# Altium schematic sheet Sheet4.SchDoc
size A4; SheetNumber: 4; SheetTotal: 6
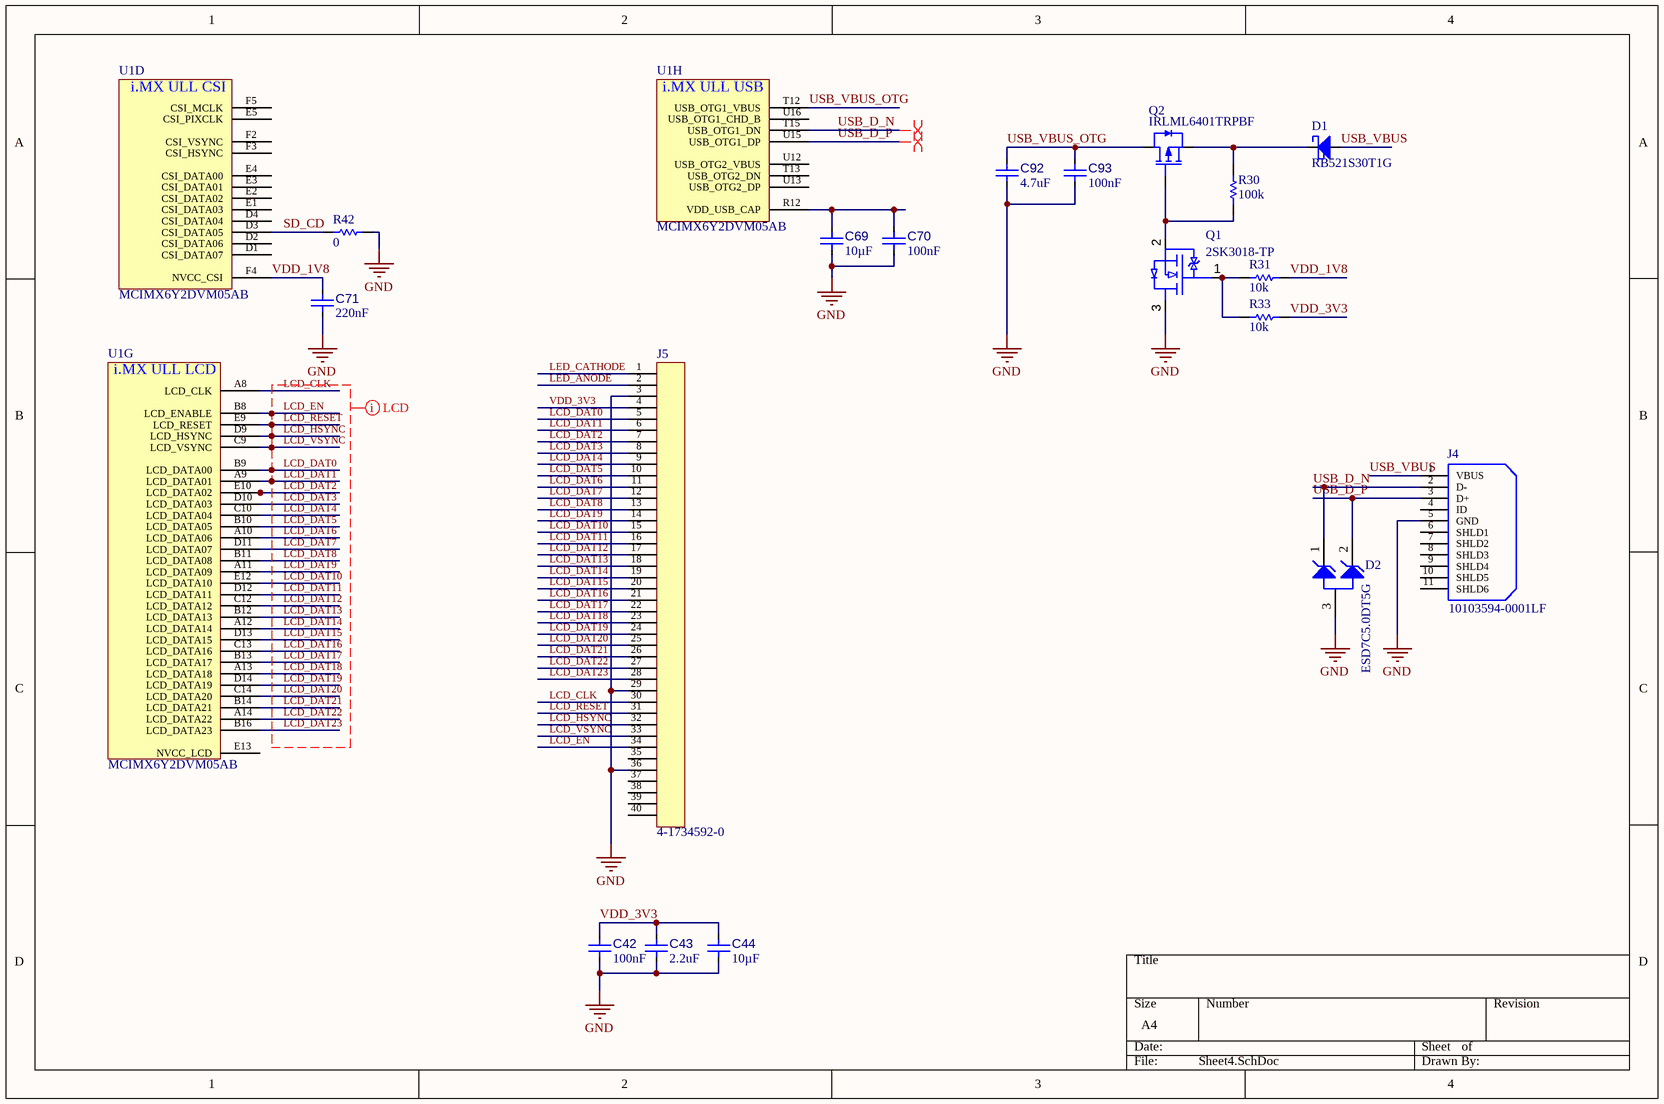
[diagram p0: Sheet4.SchDoc]

## Parts
C42  value 100nF  [0402-SMD-CAP]  (hidden comment: EMF105B7104MVHF)
C43  value 2.2uF  [0603-SMD-CAP]  (hidden comment: GRM188R71A225KE15D)
C44  value 10µF  [0805-SMD-CAP]  (hidden comment: 0805YD106KAT2A)
C69  value 10µF  [0603-SMD-CAP]  (hidden comment: 0603ZD106KAT2A)
C70  value 100nF  [0402-SMD-CAP]  (hidden comment: EMF105B7104MVHF)
C71  value 220nF  [0402-SMD-CAP]  (hidden comment: GRM155R71C224KA12D)
C92  value 4.7uF  [0603-SMD-CAP]  (hidden comment: C0603C475K9PACTU)
C93  value 100nF  [0402-SMD-CAP]  (hidden comment: EMF105B7104MVHF)
D1  RB521S30T1G  [ONSC-SOD-523-2-502-01_V]
D2  ESD7C5.0DT5G  [ONSC-SOT-723-3-631AA-01_V]
J4  10103594-0001LF  [FCI-10103594-0001LF_V]
J5  4-1734592-0  [4-1734592-0-Footprint-1]
Q1  2SK3018-TP  [SOT323]
Q2  IRLML6401TRPBF  [SOT323-IRLML6401]
R30  value 100k  [0402_SMD_RES]  (hidden comment: RC0402FR-07100KL)
R31  value 10k  [0402_SMD_RES]  (hidden comment: Resistor 10k +/-1% 0402 63 mW)
R33  value 10k  [0402_SMD_RES]  (hidden comment: Resistor 10k +/-1% 0402 63 mW)
R42  value 0  [0402_SMD_RES]  (hidden comment: RCS04020000Z0ED)
U1  MCIMX6Y2DVM05AB  [BGA100P9X9-81A]  (parts D,G,H of 11)

## Nets
GND: C42.1 C43.1 C44.2 C69.2 C70.1 C71.2 C92.2 C93.1 D2.3(A) J4.5(GND) J5.3 J5.29 J5.36 Q1.3(D) R42.2
LCD_CLK: J5.30 U1.A8(LCD_CLK)
LCD_DAT0: J5.5 U1.B9(LCD_DATA00)
LCD_DAT1: J5.6 U1.A9(LCD_DATA01)
LCD_DAT2: J5.7 U1.E10(LCD_DATA02)
LCD_DAT3: J5.8 U1.D10(LCD_DATA03)
LCD_DAT4: J5.9 U1.C10(LCD_DATA04)
LCD_DAT5: J5.10 U1.B10(LCD_DATA05)
LCD_DAT6: J5.11 U1.A10(LCD_DATA06)
LCD_DAT7: J5.12 U1.D11(LCD_DATA07)
LCD_DAT8: J5.13 U1.B11(LCD_DATA08)
LCD_DAT9: J5.14 U1.A11(LCD_DATA09)
LCD_DAT10: J5.15 U1.E12(LCD_DATA10)
LCD_DAT11: J5.16 U1.D12(LCD_DATA11)
LCD_DAT12: J5.17 U1.C12(LCD_DATA12)
LCD_DAT13: J5.18 U1.B12(LCD_DATA13)
LCD_DAT14: J5.19 U1.A12(LCD_DATA14)
LCD_DAT15: J5.20 U1.D13(LCD_DATA15)
LCD_DAT16: J5.21 U1.C13(LCD_DATA16)
LCD_DAT17: J5.22 U1.B13(LCD_DATA17)
LCD_DAT18: J5.23 U1.A13(LCD_DATA18)
LCD_DAT19: J5.24 U1.D14(LCD_DATA19)
LCD_DAT20: J5.25 U1.C14(LCD_DATA20)
LCD_DAT21: J5.26 U1.B14(LCD_DATA21)
LCD_DAT22: J5.27 U1.A14(LCD_DATA22)
LCD_DAT23: J5.28 U1.B16(LCD_DATA23)
LCD_EN: J5.34 U1.B8(LCD_ENABLE)
LCD_HSYNC: J5.32 U1.D9(LCD_HSYNC)
LCD_RESET: J5.31 U1.E9(LCD_RESET)
LCD_VSYNC: J5.33 U1.C9(LCD_VSYNC)
LED_ANODE: J5.2
LED_CATHODE: J5.1
SD_CD: R42.1 U1.D3(CSI_DATA05)
USB_D_N: D2.1(K1) J4.2(D-) U1.T15(USB_OTG1_DN)
USB_D_P: D2.2(K2) J4.3(D+) U1.U15(USB_OTG1_DP)
USB_VBUS: D1.1(A) J4.1(VBUS)
USB_VBUS_OTG: C92.1 C93.2 Q2.3(DRAIN) U1.T12(USB_OTG1_VBUS)
VDD_1V8: C71.1 R31.1 U1.F4(NVCC_CSI)
VDD_3V3: C42.2 C43.2 C44.1 J5.4 R33.1
NetC69_1: C69.1 C70.2 U1.R12(VDD_USB_CAP)
NetD1_2: D1.2(K) Q2.2(SOURCE) R30.2
NetQ1_1: Q1.1(G) R31.2 R33.2
NetQ1_2: Q1.2(S) Q2.1(GATE) R30.1

Not connected (* = marked no-connect by the designer): J4 4(ID) 6(SHLD1) 7(SHLD2) 8(SHLD3) 9(SHLD4) 10(SHLD5) 11(SHLD6); J5 35 37 38 39 40; U1 D1(CSI_DATA07) D2(CSI_DATA06) D4(CSI_DATA04) E1(CSI_DATA03) E2(CSI_DATA02) E3(CSI_DATA01) E4(CSI_DATA00) E5(CSI_PIXCLK) E13(NVCC_LCD) F2(CSI_VSYNC) F3(CSI_HSYNC) F5(CSI_MCLK) T13(USB_OTG2_DN) U12(USB_OTG2_VBUS) U13(USB_OTG2_DP) U16(USB_OTG1_CHD_B)

## Layout directives
net class LCD: LCD_CLK, LCD_DAT0, LCD_DAT1, LCD_DAT2, LCD_DAT3, LCD_DAT4, LCD_DAT5, LCD_DAT6, LCD_DAT7, LCD_DAT8, LCD_DAT9, LCD_DAT10, LCD_DAT11, LCD_DAT12, LCD_DAT13, LCD_DAT14, LCD_DAT15, LCD_DAT16, LCD_DAT17, LCD_DAT18, LCD_DAT19, LCD_DAT20, LCD_DAT21, LCD_DAT22, LCD_DAT23, LCD_EN, LCD_HSYNC, LCD_RESET, LCD_VSYNC
differential pair: USB_D_N, USB_D_P

## Notes on the sheet
- (in symbol CMP-003-000001-14, part D) i.MX ULL CSI
- (in symbol CMP-003-000001-14, part G) i.MX ULL LCD
- (in symbol CMP-003-000001-14, part H) i.MX ULL USB

## Library data of the parts
C42 C70 C93 = CMP-001-00001-14: Chip Capacitor, 0.1 uF, +/- 5%, 16 V, 0402 (1005 Metric); Capacitor Type: Ceramic; Voltage Rating: 16V; Case/Package: 0402; Max Operating Temperature: 125°C; Mounting Technology: SM; RoHS Compliant: True; Pins: 2; Min Operating Temperature: -55°C; Tolerance: 5%; Mfr. Part No.: EMF105B7104MVHF
C43 = CMP-001-00083-8: CAP CER 2.2UF 10V X7R 0603; Tolerance: 10%; Material: Ceramic; Height: 0.8mm; Capacitance: 2.2uF; Case Code (Imperial): 0603; Termination: Standard; Voltage Rating (DC): 10V; Voltage: 10V; RoHS Compliant: Yes; Length: 1.6mm; Thickness: 0.035inch; Case Code (Metric): 1608; REACH SVHC: No SVHC; Package Quantity: 4000; Case/Package: 0603; Mount: Surface Mount; Depth: 0.8mm; Packaging: Cut Tape; Lead Free: Lead Free; Series: GRM; Width: 0.8mm; Dielectric: X7R; Number of Pins: 2; Weight: 0.000222oz; Max Operating Temperature: 125°C; Voltage Rating: 10V; Min Operating Temperature: -55°C
C44 = CMP-001-00015-12: Chip Capacitor, 10 uF, +/- 10%, 16 V, 0805 (2012 Metric); Capacitor Type: Ceramic; Voltage Rating: 16V; Pins: 2; Mounting Technology: SM; Max Operating Temperature: 85°C; Tolerance: 10%; Case/Package: 0805; RoHS Compliant: True; Min Operating Temperature: -55°C; Mfr. Part No.: 0805YD106KAT2A
C69 = CMP-001-00075-11: Chip Capacitor, 10µF +/-20%, 10V, 0603, Thickness 1 mm; Tolerance: 10%; Pins: 2; Case/Package: 0603; Mounting Technology: SMT; Max Operating Temperature: 85°C; Min Operating Temperature: -55°C; Voltage Rating: 10V; Mfr. Part No.: 0603ZD106KAT2A
C71 = CMP-001-00090-10: MURATA - GRM155R71C224KA12D - SMD Multilayer Ceramic Capacitor, 0.22 µF, 16 V, 0402 [1005 Metric], ± 10%, X7R, GRM Series; Voltage: 16V; Package Quantity: 1; Height: 0.5mm; Tolerance: 10%; Case/Package: 0402; Case Code (Metric): 1005; Packaging: Tape and Reel; Min Operating Temperature: -55°C; Mount: Surface Mount; RoHS Compliant: Yes; Thickness: 0.022inch; Depth: 0.5mm; Lead Free: Lead Free; Series: GRM; REACH SVHC: No SVHC; Width: 0.02inch; Voltage Rating: 16V; Material: Ceramic; Radiation Hardening: No; Voltage Rating (DC): 16V; Capacitance: 220nF; Max Operating Temperature: 125°C; Length: 1mm; Construction: Flat; Dielectric: X7R; Termination: SMD/SMT; Case Code (Imperial): 0402
C92 = CMP-001-00092-7: KEMET - C0603C475K9PACTU - SMD Multilayer Ceramic Capacitor, 4.7 µF, 6.3 V, 0603 [1608 Metric], ± 10%, X5R, C Series KEMET; Dissipation Factor: 5%; Voltage Rating: 6.3V; Radiation Hardening: No; Lead Pitch: 0.7mm; Case Code (Metric): 1608; Case Code (Imperial): 0603; Length: 1.6mm; Series: C; Dielectric Material: Ceramic; Height: 0.8mm; Package Quantity: 1; Termination: SMD/SMT; Dielectric: X5R; Thickness: 0.035inch; Mount: Surface Mount,PCB; Construction: Flat; Capacitance: 4.7uF; RoHS Compliant: Yes; REACH SVHC: No SVHC; Tolerance: 10%; Number of Pins: 2; Width: 0.031inch; Contact Plating: Tin,Matte; Packaging: Tape and Reel; Case/Package: 0603; Max Operating Temperature: 85°C; Lead Free: Lead Free; Depth: 0.8mm; Voltage: 6.3V; Min Operating Temperature: -55°C; Voltage Rating (DC): 6.3V
D1 = CMP-004-00031-4: ON SEMICONDUCTOR - RB521S30T1G - Small Signal Schottky Diode, Single, 30 V, 200 mA, 500 mV, 1 A, 125 °C; Max Reverse Voltage (DC): 30V; Forward Voltage: 500mV; Polarity: Standard; Peak Non-Repetitive Surge Current: 1A; Average Rectified Current: 200mA; Power Dissipation: 200mW; Max Reverse Current: 30uA; RoHS Compliant: Yes; Width: 0.9mm; Voltage Rating (DC): 30V; Max Operating Temperature: 125°C; Radiation Hardening: No; Element Configuration: Single; Height: 0.7mm; Number of Pins: 2; Max Forward Surge Current (Ifsm): 1A; Package Quantity: 1; REACH SVHC: No SVHC; Lead Free: Lead Free; Packaging: Tape and Reel; Current Rating: 200mA; Output Current: 200mA; Forward Current: 200mA; Length: 1.3mm; Max Repetitive Reverse Voltage (Vrrm): 30V; Max Surge Current: 1A; Contact Plating: Tin,Matte; Max Reverse Leakage Current: 30uA; Case/Package: SOD-523-2; Min Operating Temperature: -55°C
D2 = CMP-004-00032-2: ESD Suppressor TVS 15KV 3-Pin SOT-723 T/R; Test Current: 1mA; ESD Protection: Yes; Max Power Dissipation: 240mW; Diode Type: ZENER; Number of Lines: 2; Capacitance: 6.2pF; Power Line Protection: No; Clamping Voltage-Max: 10V; Max Breakdown Voltage: 11V; Max Reverse Leakage Current: 500nA; Polarity: Unidirectional; Element Configuration: Common Anode; Reverse Standoff Voltage: 5V; Number of Pins: 3; Halogen Free: Halogen Free; Contact Plating: Tin,Matte; Packaging: Tape and Reel; Height: 0.55mm; Depth: 0.8mm; Package Quantity: 1; Series: Automotive, AEC-Q101; RoHS Compliant: Yes; Length: 1.2mm; Peak Pulse Power: 240mW; Number of Unidirectional Channels: 2; Case/Package: SOT-723-3; Termination: SMD/SMT; Min Operating Temperature: -55°C; Lead Free: Lead Free; Radiation Hardening: No; Resistor Type: Zener; Min Breakdown Voltage: 11V; Max Operating Temperature: 150°C; Direction: Unidirectional; Clamping Voltage: 10V; Working Voltage: 5V; Operating Supply Voltage: 5V; Number of Channels: 2; REACH SVHC: No SVHC; Leakage Current: 500nA; Width: 0.85mm; Breakdown Voltage: 11V
J4 = CMP-002-00038-7: Micro USB 2.0 B Receptacle, 5 Position, Height 3.24 mm, -55 to 85 degC, RoHS, Tape and Reel; Manufacturer: FCI Electronics; Voltage Rating: 100V; Gender: Female; Current Rating: 1.8A; Min Operating Temperature: -55°C; Pins: 5; Contact Plating: Gold; Package Description: 5-Pin Surface Mount Device, Body 8.04 x 5.62 mm; RoHS Compliant: True; Lead Pitch: 0.65mm; Packaging: TapeandReel; Case/Package: FCI-10103594-0001LF; Manufacturer URL: http://portal.fciconnect.com/; Mounting Technology: SM; Datasheet Version: Rev. A, 06/2010; Connector Type: USB; Contact Material: Copper; Datasheet URL: http://portal.fciconnect.com/Comergent//fci/drawing/10103594.pdf; Max Operating Temperature: 85°C; Package Quantity: 1500; Package Reference: FCI-10103594-0001LF
J5 = CMP-002-00074-4: FFC/FPC CONNECTOR, RECEPTACLE 40 POSITION 1ROW; Product Range:-; Contact Termination Type:Surface Mount; Gender:Receptacle; No. of Contacts:40; Contact Position:Bottom; Pitch Spacing:0.5mm; FFC / FPC Thickness:0.3mm; No. of Rows:1 ;RoHS Compliant: Yes; Number of Positions: 40; Contact Current Rating: 500mA; Pitch: 0.5mm; Plating Thickness: 0.025um; Contact Location: Bottom; Contact Resistance: 35mR; Actuator Color: Beige; PCB Mount Alignment: No (Without); PCB Mounting Orientation: Right Angle; Wire/Cable Type: Flat Flex; Max Voltage Rating (AC): 250V; PCB Mount Retention: With; Connector System: Flex-to-Board; Gender: Female; Shrouded: Yes (With); Shielding: Unshielded; Connector Type: Receptacle,Connector,Socket; Actuator Material: Thermoplastic; Housing Color: Natural; RoHS Compliant: Yes; Housing Material: Polymer; Series: -; Number of Contacts: 40; Contact Material: Bronze; Lead Free: Lead Free; Package Quantity: 2000; Min Operating Temperature: -40°C; REACH SVHC: No SVHC; Depth: 5.1mm; Number of Rows: 1; Length: 25.43mm; ELV: Compliant; Flammability Rating: UL94 V-0; Current Rating: 500mA; Termination: SMD/SMT; Voltage Rating: 250V; Height: 2.05mm; Radiation Hardening: No; Contact Plating: Gold; Mating Alignment: Yes (With); Width: 5.1mm; Max Operating Temperature: 85°C; Packaging: Tape and Reel; Orientation: Right Angle; Mount: Surface Mount; Sealable: No (Without)
Q1 = CMP-013-00034-6: N-CHANNEL MOSFET, SOT-323 PACKAG; Max Power Dissipation: 200mW; Rds On Max: 8R; Continuous Drain Current (ID): 100mA; Drain to Source Voltage (Vdss): 30V; Input Capacitance: 13pF; Min Operating Temperature: -55°C; Case/Package: SOT-323; Mount: Surface Mount; Packaging: Tape and Reel; Max Operating Temperature: 150°C
Q2 = CMP-013-00035-10: Trans MOSFET P-CH 12V 4.3A 3-Pin Micro T/R; Drain to Source Resistance: 50mR; Turn-On Delay Time: 11ns; Element Configuration: Single; Nominal Vgs: -550mV; Max Power Dissipation: 1.3W; Voltage Rating (DC): -12V; Current Rating: -4.3A; Rise Time: 32ns; Turn-Off Delay Time: 250ns; Fall Time: 210ns; Number of Elements: 1; Input Capacitance: 830pF; Gate to Source Voltage (Vgs): 8V; Length: 3.04mm; Series: HEXFET®; Termination: SMD/SMT; Packaging: Tape and Reel; Lead Free: Lead Free; Power Dissipation: 1.3W; RoHS Compliant: Yes; Package Quantity: 1; Threshold Voltage: -550mV; Continuous Drain Current (ID): 4.3A; Dual Supply Voltage: -12V; Max Operating Temperature: 150°C; Mount: Surface Mount; Drain to Source Breakdown Voltage: -12V; Height: 1.02mm; Min Operating Temperature: -55°C; Drain to Source Voltage (Vdss): 12V; Rds On Max: 50mR; Width: 1.4mm; Radiation Hardening: No; Case/Package: TO-236-3; Number of Pins: 3; On-State Resistance: 50mR; REACH SVHC: No SVHC; Value: IRLML6401TRPBF
R30 = CMP-009-00021-11: Chip Resistor, 100 KOhm, +/- 1%, 0.063 W, -55 to 155 degC, 0402 (1005 Metric); Voltage Rating: 50V; Power: 63mW; RoHS Compliant: True; Max Operating Temperature: 155°C; Tolerance: 1%; Min Operating Temperature: -55°C; Case/Package: 0402; Mounting Technology: SM; Pins: 2; Mfr. Part No.: RC0402FR-07100KL
R31 R33 = CMP-009-00019-13: Chip Resistor, 10 KOhm, +/- 1%, 63 mW, -55 to 155 degC, 0402 (1005 Metric); Voltage Rating: 50V; Power: 63mW; Min Operating Temperature: -55°C; Pins: 2; Case/Package: 0402; Max Operating Temperature: 155°C; Resistance: 10k; Mounting Technology: SM; RoHS Compliant: True; Tolerance: 1%
R42 = CMP-009-00005-12: Chip Resistor, 0 Ohm, 0.1 W, -55 to 155 degC, 0402 (1005 Metric); Voltage Rating: 50V; Tolerance: 5%; Power: 100mW; Min Operating Temperature: -55°C; Mounting Technology: SM; RoHS Compliant: True; Max Operating Temperature: 155°C; Pins: 2; Case/Package: 0402; Mfr. Part No.: RCS04020000Z0ED
U1 = CMP-003-000001-14: Package: MAPBGA; Design Item ID: MCIMX6Y2DVM05AB; Mfr. Part Nr.: MCIMX6Y2DVM05AB; Source: Schlib1.SchLib